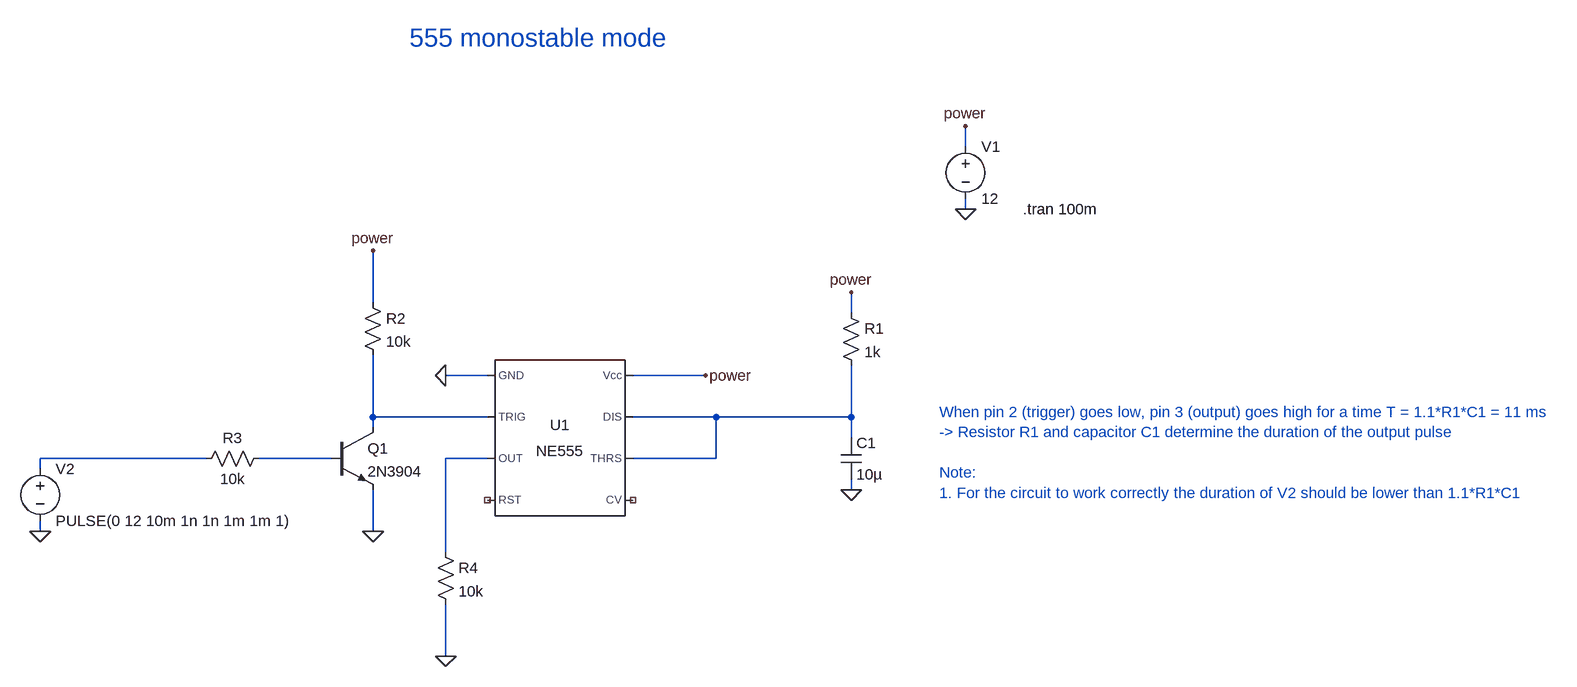
[diagram p0: schematic 555-monostable-mode.asc]
555-monostable-mode.asc, the LTspice schematic file:
Version 4.1
SHEET 1 1844 680
WIRE 896 -320 896 -352
WIRE 896 -224 896 -240
WIRE -16 -80 -16 -160
WIRE 720 -64 720 -96
WIRE 160 32 96 32
WIRE 496 32 384 32
WIRE -16 96 -16 0
WIRE 160 96 -16 96
WIRE 512 96 384 96
WIRE 720 96 720 16
WIRE 720 96 512 96
WIRE -16 112 -16 96
WIRE 720 128 720 96
WIRE -272 160 -528 160
WIRE -80 160 -192 160
WIRE 160 160 96 160
WIRE 512 160 512 96
WIRE 512 160 384 160
WIRE -528 176 -528 160
WIRE 720 208 720 192
WIRE -528 272 -528 256
WIRE -16 272 -16 208
WIRE 96 304 96 160
WIRE 96 464 96 384
FLAG 496 32 power
FLAG 96 32 0
FLAG 896 -224 0
FLAG 896 -352 power
FLAG 720 208 0
FLAG 720 -96 power
FLAG -16 272 0
FLAG -16 -160 power
FLAG -528 272 0
FLAG 96 464 0
SYMBOL Misc\\NE555 272 128 R0
SYMATTR InstName U1
SYMBOL voltage 896 -336 R0
WINDOW 123 0 0 Left 0
WINDOW 39 0 0 Left 0
SYMATTR InstName V1
SYMATTR Value 12
SYMBOL res 704 -80 R0
SYMATTR InstName R1
SYMATTR Value 1k
SYMBOL cap 704 128 R0
SYMATTR InstName C1
SYMATTR Value 10µ
SYMBOL res -32 -96 R0
SYMATTR InstName R2
SYMATTR Value 10k
SYMBOL npn -80 112 R0
SYMATTR InstName Q1
SYMATTR Value 2N3904
SYMBOL voltage -528 160 R0
WINDOW 123 0 0 Left 0
WINDOW 39 0 0 Left 0
SYMATTR InstName V2
SYMATTR Value PULSE(0 12 10m 1n 1n 1m 1m 1)
SYMBOL res -176 144 R90
WINDOW 0 0 56 VBottom 2
WINDOW 3 32 56 VTop 2
SYMATTR InstName R3
SYMATTR Value 10k
SYMBOL res 80 288 R0
SYMATTR InstName R4
SYMATTR Value 10k
TEXT 984 -224 Left 2 !.tran 100m
TEXT 856 88 Left 2 ;When pin 2 (trigger) goes low, pin 3 (output) goes high for a time T = 1.1*R1*C1 = 11 ms\n-> Resistor R1 and capacitor C1 determine the duration of the output pulse\n \nNote:\n1. For the circuit to work correctly the duration of V2 should be lower than 1.1*R1*C1
TEXT 40 -488 Left 4 ;555 monostable mode

The netlist it stands for:
* 555-monostable-mode.asc
X§U1 0 N001 N005 NC_01 NC_02 N002 N002 power NE555  ; pins GND TRIG OUT RST CV THRS DIS Vcc
V1 power 0 12
R1 power N002 1k
C1 N002 0 10µ
R2 power N001 10k
Q1 N001 N004 0 0 2N3904
V2 N003 0 PULSE(0 12 10m 1n 1n 1m 1m 1)
R3 N004 N003 10k
R4 N005 0 10k
.model NPN NPN
.model PNP PNP
.lib standard.bjt
.tran 100m
* When pin 2 (trigger) goes low, pin 3 (output) goes high for a time T = 1.1*R1*C1 = 11 ms
* -> Resistor R1 and capacitor C1 determine the duration of the output pulse
* Note:
* 1. For the circuit to work correctly the duration of V2 should be lower than 1.1*R1*C1
* 555 monostable mode
.lib NE555.sub
.backanno
.end